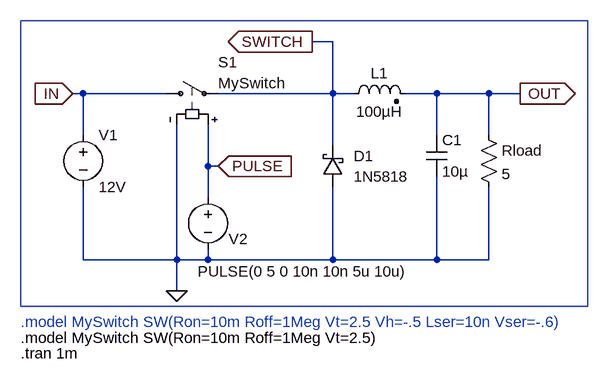
[diagram p0: schematic Switch-Mode_Power_Supplies_-_Basso-_Figure_1-11d.asc]
Switch-Mode_Power_Supplies_-_Basso-_Figure_1-11d.asc, the LTspice schematic file:
Version 4
SHEET 1 880 1052
WIRE -672 -192 -704 -192
WIRE -1056 -112 -1072 -112
WIRE -928 -112 -1056 -112
WIRE -672 -112 -672 -192
WIRE -672 -112 -848 -112
WIRE -640 -112 -672 -112
WIRE -512 -112 -560 -112
WIRE -432 -112 -512 -112
WIRE -384 -112 -432 -112
WIRE -1056 -48 -1056 -112
WIRE -512 -48 -512 -112
WIRE -432 -48 -432 -112
WIRE -672 -32 -672 -112
WIRE -864 0 -864 -64
WIRE -848 0 -864 0
WIRE -864 48 -864 0
WIRE -1056 144 -1056 32
WIRE -912 144 -912 -64
WIRE -912 144 -1056 144
WIRE -864 144 -864 128
WIRE -864 144 -912 144
WIRE -672 144 -672 32
WIRE -672 144 -864 144
WIRE -512 144 -512 16
WIRE -512 144 -672 144
WIRE -432 144 -432 32
WIRE -432 144 -512 144
WIRE -912 192 -912 144
FLAG -384 -112 OUT
IOPIN -384 -112 Out
FLAG -912 192 0
FLAG -1072 -112 IN
IOPIN -1072 -112 In
FLAG -848 0 PULSE
IOPIN -848 0 In
FLAG -704 -192 SWITCH
IOPIN -704 -192 Out
SYMBOL voltage -1056 -64 R0
WINDOW 123 0 0 Left 0
WINDOW 39 0 0 Left 0
SYMATTR InstName V1
SYMATTR Value 12V
SYMBOL res -448 -64 R0
SYMATTR InstName Rload
SYMATTR Value 5
SYMBOL sw -944 -112 R270
WINDOW 0 48 96 VRight 0
WINDOW 3 16 96 VRight 0
SYMATTR InstName S1
SYMATTR Value MySwitch
SYMBOL voltage -864 32 R0
WINDOW 0 32 80 Left 0
WINDOW 3 -16 130 Left 0
WINDOW 123 0 0 Left 0
WINDOW 39 0 0 Left 0
SYMATTR InstName V2
SYMATTR Value PULSE(0 5 0 10n 10n 5u 10u)
SYMBOL ind2 -656 -96 R270
WINDOW 0 32 56 VTop 0
WINDOW 3 4 56 VBottom 0
SYMATTR InstName L1
SYMATTR Value 100µH
SYMBOL cap -528 -48 R0
SYMATTR InstName C1
SYMATTR Value 10µ
SYMBOL schottky -656 32 R180
WINDOW 0 -16 48 Right 0
WINDOW 3 -16 16 Right 0
SYMATTR InstName D1
SYMATTR Value 1N5818
SYMATTR Description Diode
SYMATTR Type diode
TEXT -1152 288 Left 0 !.tran 1m
TEXT -1152 264 Left 0 !.model MySwitch SW(Ron=10m Roff=1Meg Vt=2.5)
TEXT -1152 240 Left 0 ;.model MySwitch SW(Ron=10m Roff=1Meg Vt=2.5 Vh=-.5 Lser=10n Vser=-.6)
RECTANGLE Normal -280 216 -1152 -224

The netlist it stands for:
* Switch-Mode_Power_Supplies_-_Basso-_Figure_1-11d.asc
V1 IN 0 12V
Rload OUT 0 5
S1 IN SWITCH PULSE 0 MySwitch
V2 PULSE 0 PULSE(0 5 0 10n 10n 5u 10u)
L1 SWITCH OUT 100µH
C1 OUT 0 10µ
D1 0 SWITCH 1N5818
.model D D
.lib standard.dio
.tran 1m
.model MySwitch SW(Ron=10m Roff=1Meg Vt=2.5)
* .model MySwitch SW(Ron=10m Roff=1Meg Vt=2.5 Vh=-.5 Lser=10n Vser=-.6)
.backanno
.end